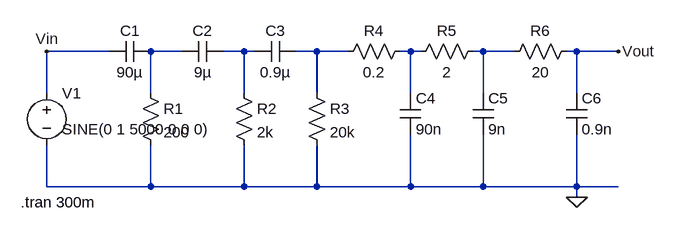
[diagram p0: schematic ec ass1.asc]
ec ass1.asc, the LTspice schematic file:
Version 4
SHEET 1 968 680
WIRE 112 80 16 80
WIRE 224 80 176 80
WIRE 320 80 288 80
WIRE 336 80 320 80
WIRE 432 80 400 80
WIRE 480 80 432 80
WIRE 576 80 560 80
WIRE 592 80 576 80
WIRE 688 80 672 80
WIRE 736 80 688 80
WIRE 832 80 816 80
WIRE 896 80 832 80
WIRE 16 144 16 80
WIRE 176 144 176 80
WIRE 320 144 320 80
WIRE 432 144 432 80
WIRE 576 144 576 80
WIRE 688 144 688 80
WIRE 832 144 832 80
WIRE 16 288 16 224
WIRE 176 288 176 224
WIRE 176 288 16 288
WIRE 320 288 320 224
WIRE 320 288 176 288
WIRE 432 288 432 224
WIRE 432 288 320 288
WIRE 576 288 576 208
WIRE 576 288 432 288
WIRE 688 288 688 208
WIRE 688 288 576 288
WIRE 832 288 832 208
WIRE 832 288 688 288
WIRE 896 288 832 288
WIRE 832 304 832 288
FLAG 832 304 0
FLAG 896 80 Vout
FLAG 16 80 Vin
SYMBOL voltage 16 128 R0
WINDOW 123 24 44 Left 2
WINDOW 39 0 0 Left 0
WINDOW 3 24 72 Left 2
SYMATTR Value SINE(0 1 5000 0 0 0)
SYMATTR InstName V1
SYMBOL cap 176 64 R90
WINDOW 0 0 32 VBottom 2
WINDOW 3 32 32 VTop 2
SYMATTR InstName C1
SYMATTR Value 90µ
SYMBOL res 160 128 R0
SYMATTR InstName R1
SYMATTR Value 200
SYMBOL res 416 128 R0
SYMATTR InstName R3
SYMATTR Value 20k
SYMBOL res 576 64 R90
WINDOW 0 0 56 VBottom 2
WINDOW 3 32 56 VTop 2
SYMATTR InstName R4
SYMATTR Value 0.2
SYMBOL cap 560 144 R0
SYMATTR InstName C4
SYMATTR Value 90n
SYMBOL res 832 64 R90
WINDOW 0 0 56 VBottom 2
WINDOW 3 32 56 VTop 2
SYMATTR InstName R6
SYMATTR Value 20
SYMBOL cap 816 144 R0
SYMATTR InstName C6
SYMATTR Value 0.9n
SYMBOL res 304 128 R0
SYMATTR InstName R2
SYMATTR Value 2k
SYMBOL cap 288 64 R90
WINDOW 0 0 32 VBottom 2
WINDOW 3 32 32 VTop 2
SYMATTR InstName C2
SYMATTR Value 9µ
SYMBOL cap 400 64 R90
WINDOW 0 0 32 VBottom 2
WINDOW 3 32 32 VTop 2
SYMATTR InstName C3
SYMATTR Value 0.9µ
SYMBOL cap 672 144 R0
SYMATTR InstName C5
SYMATTR Value 9n
SYMBOL res 688 64 R90
WINDOW 0 0 56 VBottom 2
WINDOW 3 32 56 VTop 2
SYMATTR InstName R5
SYMATTR Value 2
TEXT -24 312 Left 2 !.tran 300m

The netlist it stands for:
* ec ass1.asc
V1 Vin 0 SINE(0 1 5000 0 0 0)
C1 N001 Vin 90µ
R1 N001 0 200
R3 N003 0 20k
R4 N004 N003 0.2
C4 N004 0 90n
R6 Vout N005 20
C6 Vout 0 0.9n
R2 N002 0 2k
C2 N002 N001 9µ
C3 N003 N002 0.9µ
C5 N005 0 9n
R5 N005 N004 2
.tran 300m
.backanno
.end